# EAGLE schematic Schematic (EAGLE 9.1.3)
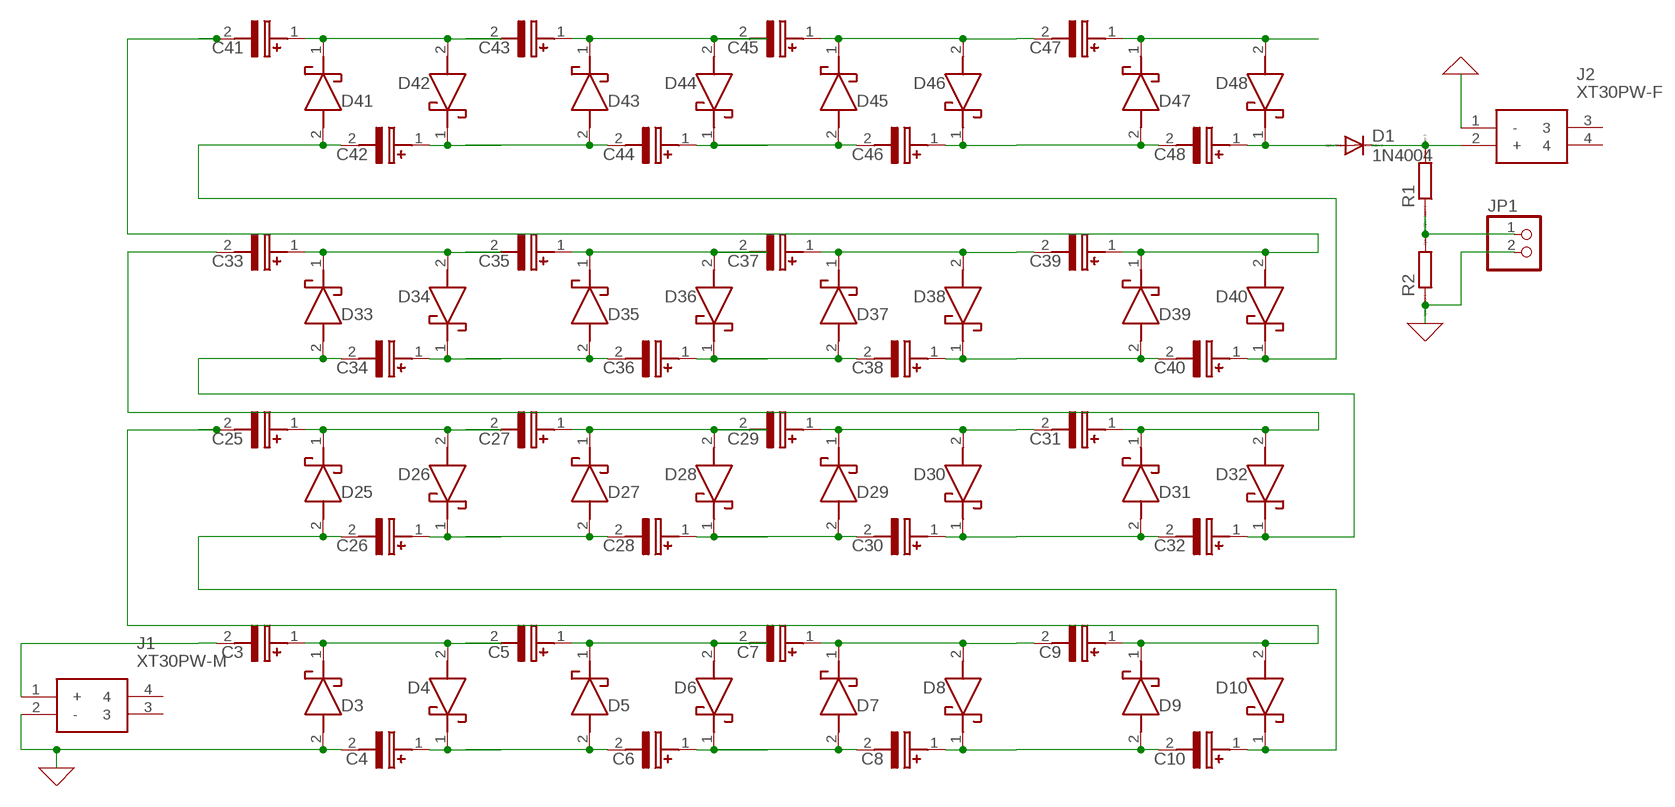
[diagram p0: schematic, sheet 1]

## Parts
C3  AFK108M25H32T-F  [CAPAE1350X1400N]
C4  AFK108M25H32T-F  [CAPAE1350X1400N]
C5  AFK108M25H32T-F  [CAPAE1350X1400N]
C6  AFK108M25H32T-F  [CAPAE1350X1400N]
C7  AFK108M25H32T-F  [CAPAE1350X1400N]
C8  AFK108M25H32T-F  [CAPAE1350X1400N]
C9  AFK108M25H32T-F  [CAPAE1350X1400N]
C10  AFK108M25H32T-F  [CAPAE1350X1400N]
C25  AFK108M25H32T-F  [CAPAE1350X1400N]
C26  AFK108M25H32T-F  [CAPAE1350X1400N]
C27  AFK108M25H32T-F  [CAPAE1350X1400N]
C28  AFK108M25H32T-F  [CAPAE1350X1400N]
C29  AFK108M25H32T-F  [CAPAE1350X1400N]
C30  AFK108M25H32T-F  [CAPAE1350X1400N]
C31  AFK108M25H32T-F  [CAPAE1350X1400N]
C32  AFK108M25H32T-F  [CAPAE1350X1400N]
C33  AFK108M25H32T-F  [CAPAE1350X1400N]
C34  AFK108M25H32T-F  [CAPAE1350X1400N]
C35  AFK108M25H32T-F  [CAPAE1350X1400N]
C36  AFK108M25H32T-F  [CAPAE1350X1400N]
C37  AFK108M25H32T-F  [CAPAE1350X1400N]
C38  AFK108M25H32T-F  [CAPAE1350X1400N]
C39  AFK108M25H32T-F  [CAPAE1350X1400N]
C40  AFK108M25H32T-F  [CAPAE1350X1400N]
C41  AFK108M25H32T-F  [CAPAE1350X1400N]
C42  AFK108M25H32T-F  [CAPAE1350X1400N]
C43  AFK108M25H32T-F  [CAPAE1350X1400N]
C44  AFK108M25H32T-F  [CAPAE1350X1400N]
C45  AFK108M25H32T-F  [CAPAE1350X1400N]
C46  AFK108M25H32T-F  [CAPAE1350X1400N]
C47  AFK108M25H32T-F  [CAPAE1350X1400N]
C48  AFK108M25H32T-F  [CAPAE1350X1400N]
D1  1N4004  [DO41-10]
D3  PMEG3050EP,115  [PMEG3050EP115]
D4  PMEG3050EP,115  [PMEG3050EP115]
D5  PMEG3050EP,115  [PMEG3050EP115]
D6  PMEG3050EP,115  [PMEG3050EP115]
D7  PMEG3050EP,115  [PMEG3050EP115]
D8  PMEG3050EP,115  [PMEG3050EP115]
D9  PMEG3050EP,115  [PMEG3050EP115]
D10  PMEG3050EP,115  [PMEG3050EP115]
D25  PMEG3050EP,115  [PMEG3050EP115]
D26  PMEG3050EP,115  [PMEG3050EP115]
D27  PMEG3050EP,115  [PMEG3050EP115]
D28  PMEG3050EP,115  [PMEG3050EP115]
D29  PMEG3050EP,115  [PMEG3050EP115]
D30  PMEG3050EP,115  [PMEG3050EP115]
D31  PMEG3050EP,115  [PMEG3050EP115]
D32  PMEG3050EP,115  [PMEG3050EP115]
D33  PMEG3050EP,115  [PMEG3050EP115]
D34  PMEG3050EP,115  [PMEG3050EP115]
D35  PMEG3050EP,115  [PMEG3050EP115]
D36  PMEG3050EP,115  [PMEG3050EP115]
D37  PMEG3050EP,115  [PMEG3050EP115]
D38  PMEG3050EP,115  [PMEG3050EP115]
D39  PMEG3050EP,115  [PMEG3050EP115]
D40  PMEG3050EP,115  [PMEG3050EP115]
D41  PMEG3050EP,115  [PMEG3050EP115]
D42  PMEG3050EP,115  [PMEG3050EP115]
D43  PMEG3050EP,115  [PMEG3050EP115]
D44  PMEG3050EP,115  [PMEG3050EP115]
D45  PMEG3050EP,115  [PMEG3050EP115]
D46  PMEG3050EP,115  [PMEG3050EP115]
D47  PMEG3050EP,115  [PMEG3050EP115]
D48  PMEG3050EP,115  [PMEG3050EP115]
J1  XT30PW-M  [XT30PWM]
J2  XT30PW-F  [XT30PWF]
JP1  PINHD-1X2  [1X02]
R1  RR0603  [R0603]
R2  RR0603  [R0603]

## Nets
0: C4.2(-) D3.2(A) J1.2(-) J2.1(-) JP1.2 R2.1 ; supply symbol labelled GND
N$1: D1.C J2.2(+) R1.2
N$2: JP1.1 R1.1 R2.2
N$5: C3.1(+) C5.2(-) D3.1(K) D4.2(A)
N$8: C3.2(-) J1.1(+)
N$9: C5.1(+) C7.2(-) D5.1(K) D6.2(A)
N$10: C4.1(+) C6.2(-) D4.1(K) D5.2(A)
N$11: C6.1(+) C8.2(-) D6.1(K) D7.2(A)
N$12: C9.1(+) C25.2(-) D9.1(K) D10.2(A)
N$14: C8.1(+) C10.2(-) D8.1(K) D9.2(A)
N$15: C10.1(+) C26.2(-) D10.1(K) D25.2(A)
N$16: C7.1(+) C9.2(-) D7.1(K) D8.2(A)
N$29: C33.1(+) C35.2(-) D33.1(K) D34.2(A)
N$31: C25.1(+) C27.2(-) D25.1(K) D26.2(A)
N$32: C31.1(+) C33.2(-) D31.1(K) D32.2(A)
N$33: C35.1(+) C37.2(-) D35.1(K) D36.2(A)
N$34: C27.1(+) C29.2(-) D27.1(K) D28.2(A)
N$35: C26.1(+) C28.2(-) D26.1(K) D27.2(A)
N$36: C28.1(+) C30.2(-) D28.1(K) D29.2(A)
N$38: C30.1(+) C32.2(-) D30.1(K) D31.2(A)
N$39: C32.1(+) C34.2(-) D32.1(K) D33.2(A)
N$40: C29.1(+) C31.2(-) D29.1(K) D30.2(A)
N$41: C34.1(+) C36.2(-) D34.1(K) D35.2(A)
N$42: C36.1(+) C38.2(-) D36.1(K) D37.2(A)
N$43: C39.1(+) C41.2(-) D39.1(K) D40.2(A)
N$44: C38.1(+) C40.2(-) D38.1(K) D39.2(A)
N$45: C40.1(+) C42.2(-) D40.1(K) D41.2(A)
N$46: C37.1(+) C39.2(-) D37.1(K) D38.2(A)
N$47: C41.1(+) C43.2(-) D41.1(K) D42.2(A)
N$48: C43.1(+) C45.2(-) D43.1(K) D44.2(A)
N$49: C42.1(+) C44.2(-) D42.1(K) D43.2(A)
N$50: C44.1(+) C46.2(-) D44.1(K) D45.2(A)
N$51: C47.1(+) D47.1(K) D48.2(A)
N$52: C46.1(+) C48.2(-) D46.1(K) D47.2(A)
N$53: C48.1(+) D1.A D48.1(K)
N$54: C45.1(+) C47.2(-) D45.1(K) D46.2(A)
Unconnected: J1.3 J1.4 J2.3 J2.4

## Library data of the parts
C3-C10 C25-C48 = AFK158M16H32T-F:AFK108M25H32T-F: Aluminium Electrolytic Capacitors - SMD 25V 1000uF 12.5X13.5 AEC-Q200 Source: Datasheet <http://www.cde.com/resources/catalogs/AFK.pdf>; ARROW_PART_NUMBER: AFK108M25H32T-F; DESCRIPTION: Aluminium Electrolytic Capacitors - SMD 25V 1000uF 12.5X13.5 AEC-Q200; HEIGHT: 14mm; MANUFACTURER_NAME: Cornell Dubilier; MANUFACTURER_PART_NUMBER: AFK108M25H32T-F; MOUSER_PART_NUMBER: 5985-AFK25V1000-F; MOUSER_PRICE-STOCK: https://www.mouser.co.uk/ProductDetail/Cornell-Dubilier-CDE/AFK108M25H32T-F?qs=lmvG2hi1dvjyxC4H6cSnyg%3D%3D
D1 = diode:1N4004: DIODE general purpose rectifier, 1 A
D3-D10 D25-D48 = PMEG3050EP_115:PMEG3050EP,115: NXP PMEG3050EP,115 SMT Schottky Diode, 30V 5A, 2-Pin SOD-128 Source: Datasheet <https://docs-emea.rs-online.com/webdocs/14cd/0900766b814cd012.pdf>; ARROW_PART_NUMBER: PMEG3050EP,115; ARROW_PRICE-STOCK: https://www.arrow.com/en/products/pmeg3050ep115/nexperia; DESCRIPTION: NXP PMEG3050EP,115 SMT Schottky Diode, 30V 5A, 2-Pin SOD-128; HEIGHT: 1mm; MANUFACTURER_NAME: Nexperia; MANUFACTURER_PART_NUMBER: PMEG3050EP,115; MOUSER_PART_NUMBER: 771-PMEG3050EP115; MOUSER_PRICE-STOCK: https://www.mouser.co.uk/ProductDetail/Nexperia/PMEG3050EP115?qs=GcY6OjH1zdmnjQ%2FhUT5aOA%3D%3D
J1 = XT30PW-M:XT30PW-M: 30A Low Temperature Rise Fire Retardant Plug Source: Datasheet <https://www.tme.eu/sl/Document/ce4077e36b79046da520ca73227e15de/XT30PW SPEC.pdf>; ARROW_PART_NUMBER: XT30PW-M; DESCRIPTION: 30A Low Temperature Rise Fire Retardant Plug; HEIGHT: 5mm; MANUFACTURER_NAME: Amass; MANUFACTURER_PART_NUMBER: XT30PW-M
J2 = XT30PW-F:XT30PW-F: Socket; DC supply; XT30; female; PIN:2; on PCBs; THT; Colour: yellow Source: Datasheet <https://www.tme.eu/Document/ce4077e36b79046da520ca73227e15de/XT30PW SPEC.pdf>; ARROW_PART_NUMBER: XT30PW-F; DESCRIPTION: Socket; DC supply; XT30; female; PIN:2; on PCBs; THT; Colour: yellow; HEIGHT: 5mm; MANUFACTURER_NAME: Amass; MANUFACTURER_PART_NUMBER: XT30PW-F
JP1 = pinhead:PINHD-1X2: PIN HEADER
R1 R2 = eagle-ltspice:R: RESISTOR, European symbol; SPICEMODEL: NONE; SPICEPREFIX: R